# Altium schematic sheet BlockDiagram.SchDoc: MSE - CSYEI : Block diagram
size A4; Author: Guillaume Volery; SheetNumber: 2; SheetTotal: 8; SVN: OUI; Version: 2.1; NoProject: <no>; TitleProject: <project>
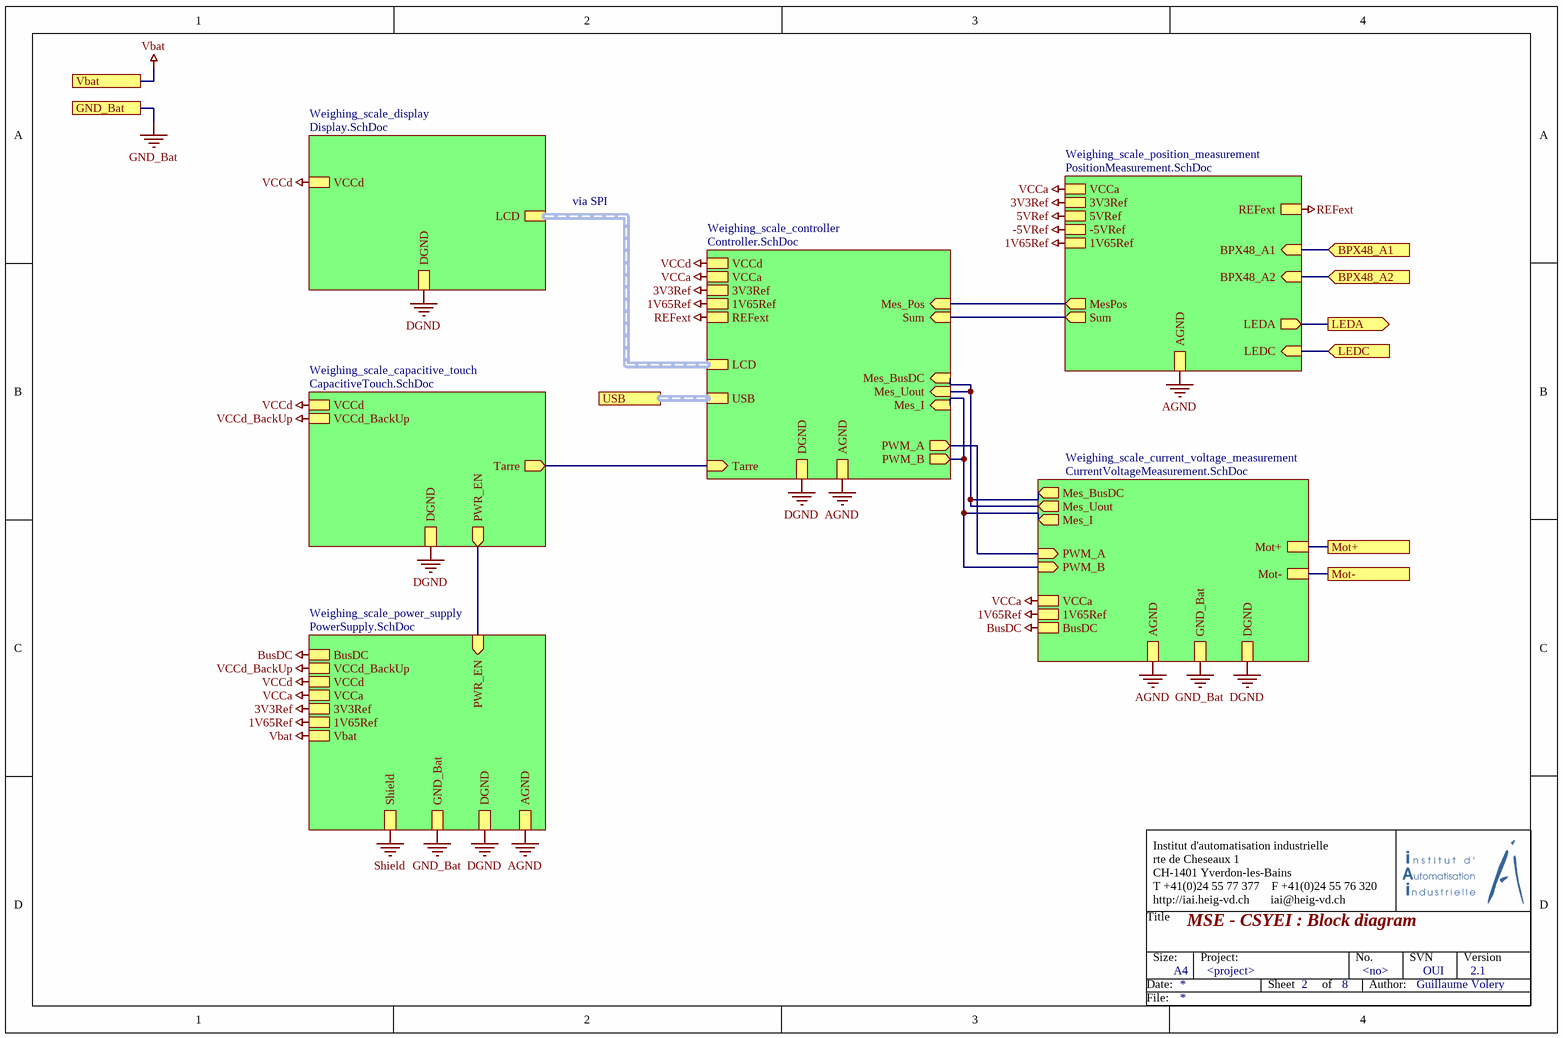
[diagram p0: BlockDiagram.SchDoc]

## Sub-sheets
Weighing_scale_capacitive_touch = CapacitiveTouch.SchDoc: Tarre (out), DGND, PWR_EN (out), VCCd, VCCd_BackUp
Weighing_scale_controller = Controller.SchDoc: VCCd, AGND, Mes_I (in), 3V3Ref, PWM_A (out), Sum (in), PWM_B (out), Mes_Pos (in), DGND, 1V65Ref, Mes_Uout (in), Tarre (in), Mes_BusDC (in), VCCa, LCD (harness LCD), USB (harness USB), REFext
Weighing_scale_current_voltage_measurement = CurrentVoltageMeasurement.SchDoc: Mot+, Mot-, Mes_BusDC (out), Mes_Uout (out), AGND, VCCa, PWM_B (in), GND_Bat, Mes_I (out), DGND, 1V65Ref, BusDC, PWM_A (in)
Weighing_scale_display = Display.SchDoc: VCCd, DGND, LCD (harness LCD)
Weighing_scale_position_measurement = PositionMeasurement.SchDoc: VCCa, MesPos (out), LEDA (out), 3V3Ref, Sum (out), LEDC (in), AGND, REFext, BPX48_A1 (in), BPX48_A2 (in), 5VRef, -5VRef, 1V65Ref
Weighing_scale_power_supply = PowerSupply.SchDoc: Vbat, GND_Bat, AGND, VCCd, BusDC, VCCa, Shield, DGND, PWR_EN (in), VCCd_BackUp, 3V3Ref, 1V65Ref

## Ports
BPX48_A1 (in), BPX48_A2 (in), GND_Bat, LEDA (out), LEDC (in), Mot+, Mot-, USB (harness USB), Vbat

## Nets
1V65Ref: sheet Weighing_scale_controller/1V65Ref, sheet Weighing_scale_power_supply/1V65Ref, sheet Weighing_scale_position_measurement/1V65Ref, sheet Weighing_scale_current_voltage_measurement/1V65Ref
3V3Ref: sheet Weighing_scale_controller/3V3Ref, sheet Weighing_scale_power_supply/3V3Ref, sheet Weighing_scale_position_measurement/3V3Ref
5VRef: sheet Weighing_scale_position_measurement/5VRef
-5VRef: sheet Weighing_scale_position_measurement/-5VRef
AGND: sheet Weighing_scale_controller/AGND, sheet Weighing_scale_power_supply/AGND, sheet Weighing_scale_position_measurement/AGND, sheet Weighing_scale_current_voltage_measurement/AGND
BusDC: sheet Weighing_scale_power_supply/BusDC, sheet Weighing_scale_current_voltage_measurement/BusDC
DGND: sheet Weighing_scale_controller/DGND, sheet Weighing_scale_display/DGND, sheet Weighing_scale_power_supply/DGND, sheet Weighing_scale_current_voltage_measurement/DGND, sheet Weighing_scale_capacitive_touch/DGND
GND_Bat: port GND_Bat, sheet Weighing_scale_power_supply/GND_Bat, sheet Weighing_scale_current_voltage_measurement/GND_Bat
REFext: sheet Weighing_scale_controller/REFext, sheet Weighing_scale_position_measurement/REFext
Shield: sheet Weighing_scale_power_supply/Shield
Vbat: port Vbat, sheet Weighing_scale_power_supply/Vbat
VCCa: sheet Weighing_scale_controller/VCCa, sheet Weighing_scale_power_supply/VCCa, sheet Weighing_scale_position_measurement/VCCa, sheet Weighing_scale_current_voltage_measurement/VCCa
VCCd: sheet Weighing_scale_controller/VCCd, sheet Weighing_scale_display/VCCd, sheet Weighing_scale_power_supply/VCCd, sheet Weighing_scale_capacitive_touch/VCCd
VCCd_BackUp: sheet Weighing_scale_power_supply/VCCd_BackUp, sheet Weighing_scale_capacitive_touch/VCCd_BackUp
BPX48_A1: port BPX48_A1, sheet Weighing_scale_position_measurement/BPX48_A1
BPX48_A2: port BPX48_A2, sheet Weighing_scale_position_measurement/BPX48_A2
LEDA: port LEDA, sheet Weighing_scale_position_measurement/LEDA
LEDC: port LEDC, sheet Weighing_scale_position_measurement/LEDC
Mot+: port Mot+, sheet Weighing_scale_current_voltage_measurement/Mot+
Mot-: port Mot-, sheet Weighing_scale_current_voltage_measurement/Mot-
(unnamed): sheet Weighing_scale_controller/Mes_I, sheet Weighing_scale_controller/PWM_B, sheet Weighing_scale_current_voltage_measurement/PWM_B, sheet Weighing_scale_current_voltage_measurement/Mes_I
(unnamed): sheet Weighing_scale_controller/PWM_A, sheet Weighing_scale_current_voltage_measurement/PWM_A
(unnamed): sheet Weighing_scale_controller/Sum, sheet Weighing_scale_position_measurement/Sum
(unnamed): sheet Weighing_scale_controller/Mes_Pos, sheet Weighing_scale_position_measurement/MesPos
(unnamed): sheet Weighing_scale_controller/Mes_Uout, sheet Weighing_scale_controller/Mes_BusDC, sheet Weighing_scale_current_voltage_measurement/Mes_BusDC, sheet Weighing_scale_current_voltage_measurement/Mes_Uout
(unnamed): sheet Weighing_scale_controller/Tarre, sheet Weighing_scale_capacitive_touch/Tarre
(unnamed): sheet Weighing_scale_power_supply/PWR_EN, sheet Weighing_scale_capacitive_touch/PWR_EN

## Buses and harness runs
harness port USB = sheet Weighing_scale_controller/USB
harness sheet Weighing_scale_controller/LCD = sheet Weighing_scale_display/LCD

## Notes on the sheet
- via SPI
- Title
- Institut d'automatisation industrielle
  rte de Cheseaux 1
  CH-1401 Yverdon-les-Bains
  T +41(0)24 55 77 377    F +41(0)24 55 76 320
  http://iai.heig-vd.ch       iai@heig-vd.ch
- Date:
- Size:
- A4
- Project:
- Sheet
- of
- No.
- Author:
- SVN
- Version
- File: